# EAGLE board 612_jetracer_esp32s3_030005 (EAGLE 9.6.2)
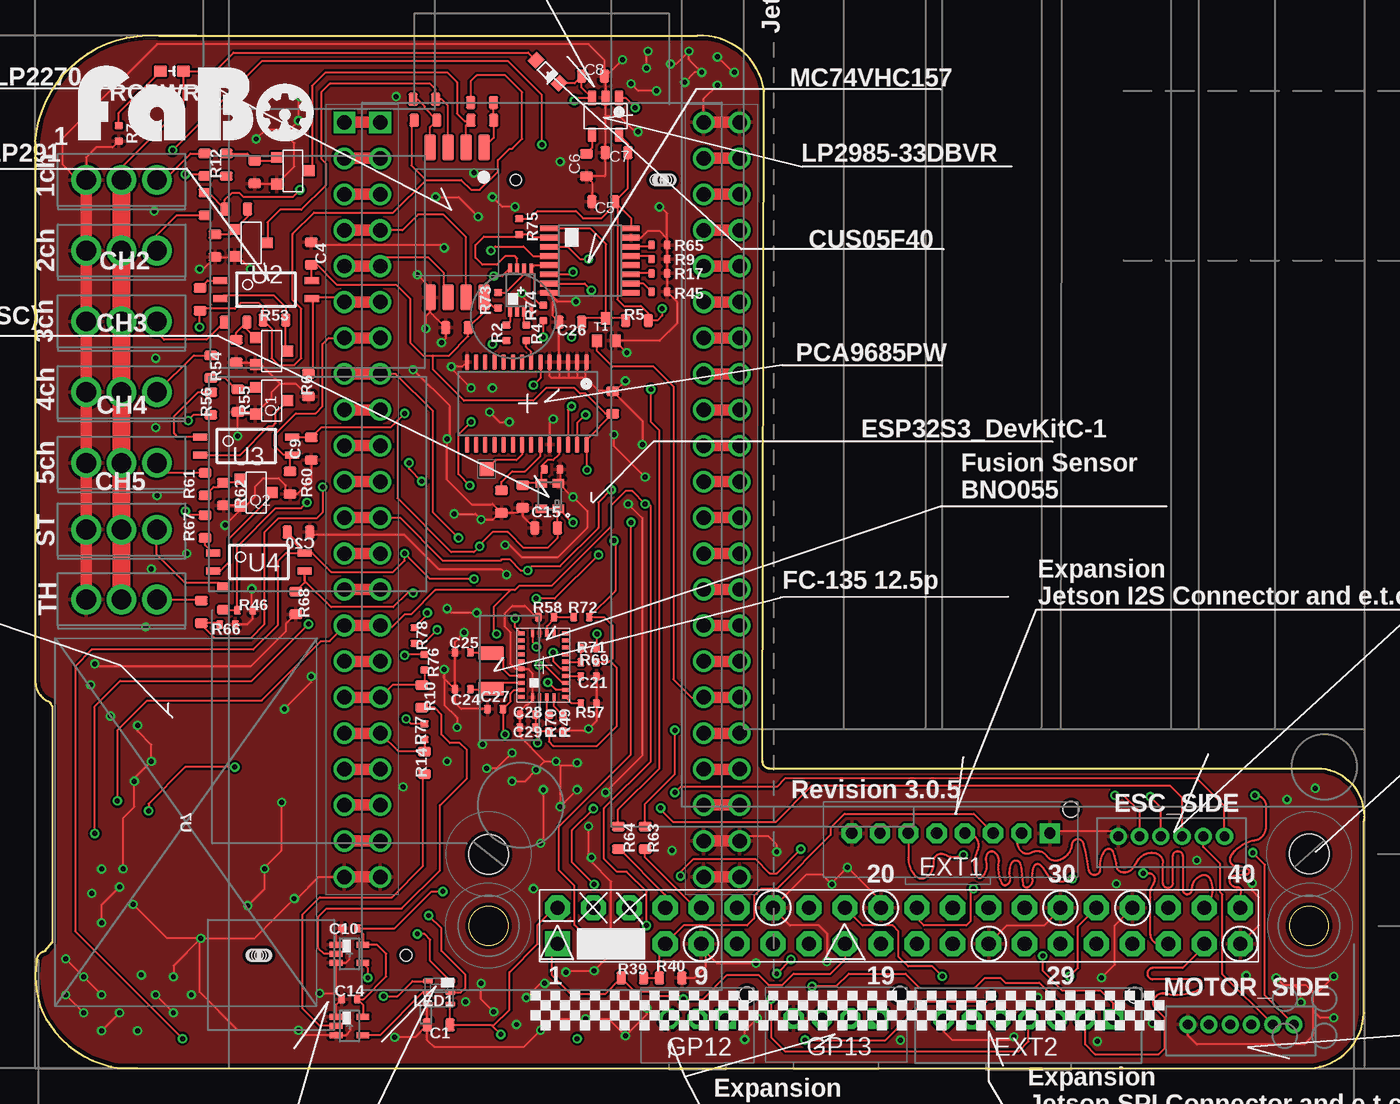
[diagram p5: board, top side]
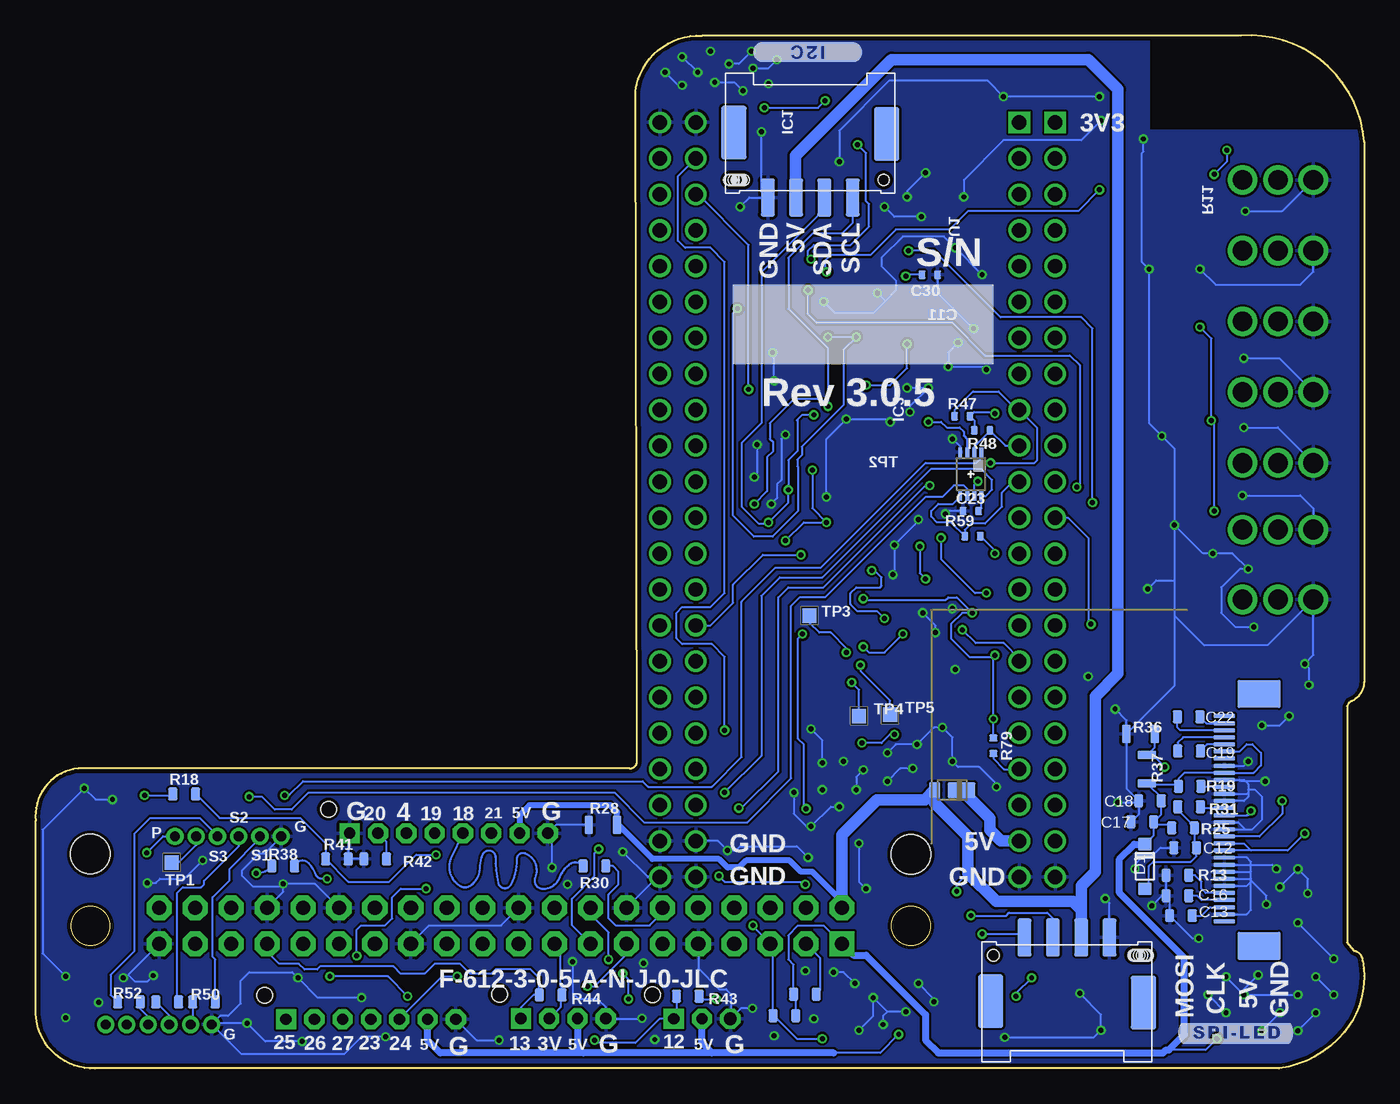
[diagram p6: board, bottom side, seen from below]

Size 93.92 x 73.02 mm. Coordinates in mm from the lower left corner, seen from the top.
Outline: 51.4,21.7 51.5,69.1 arc84 46.8,73 8.7,73 arc90 0,65.5 0,27.3 arc67 1,25.9 1.1,25.8 1.2,25.6 1.2,8.9 0.7,8.3 arc80 0.1,7.6 arc39 0.8,3.4 1,3.1 arc48 6,0 89.7,0 arc90 93.9,3.9 93.9,17.5 arc90 90.9,21.2 51.9,21.2 arc-96 51.4,21.7
Copper layers (1*16): Top 0.035mm / dielectric 1.6mm / Bottom 0.035mm
Design rules "PCBway": minimum track width 6mil, minimum drill 12mil, track to track 6mil, track to pad 6mil, pad to pad 6mil, via to via 6mil, smd to smd 6mil, copper to edge 10mil, drill to drill 10mil, minimum pad ring 10mil, minimum via ring 6mil, stop-mask expansion 2mil, vias tented up to drill 100mil, thermal gap 8mil
Holes 2.8 mm at 90.03,15.15 32.03,15.14
tKeepout: area 1.1,4.3 to 20,30.2
bKeepout: area 10.6,26.2 to 16.4,109
tRestrict: area 35.5,40 to 37.1,40.9
bRestrict: area 0.4,66.4 to 15.1,88.8; 9 lines

## Footprints (pad centres in the part's own frame; a part is rotated, then mirrored left to right if it is on the bottom)
3P-SCN = drill 1.4: 1 2.5,0; 2 0,0; 3 -2.5,0
0603 = smd 0.65 x 0.9: 1 -0.8,0; 2 0.8,0
0402 = smd 0.5 x 0.6: 1 -0.55,0; 2 0.55,0
1N4148W = smd 0.9 x 0.95: ANODE 0,0; CATHODE 3.15,0
CUS05F40 = smd 0.8 x 0.9: A -1.15,0; C 1.15,0
US2H = smd 0.8 x 1.1: A 1.25,0 | smd 2 x 1.1: K -0.65,0
B6B-ZR = drill 0.7 pad 1.016: 1 -3.75,0; 2 -2.25,0; 3 -0.75,0; 4 0.75,0; 5 2.25,0; 6 3.75,0
I2S-B08B-PASK-1 = drill 0.8 pad 1.422 octagon: 1:GND -7,0.02; 2:5V -5,0.02; 3:DOUT -3,0.02; 4:BCLK -1,0.02; 5:LRCLK 1,0.02; 6:MCK 3,0.02; 7:DIN 5,0.02 | drill 0.8 pad 1.422 square: 8:GND 7,0.02 | hole 1.1: 8.5,1.72
SPI-B07B-PASK-1 = drill 0.8 pad 1.422 octagon: 1 -6,1.27; 2 -4,1.27; 3 -2,1.27; 4 0,1.27; 5 2,1.27; 6 4,1.27 | drill 0.8 pad 1.422 square: 7 6,1.27 | hole 1.1: 7.5,2.97
FABO_BRICK_3PIN_B03B-PASK-1 = drill 0.9 pad 1.422 octagon: GND -2,0 | drill 0.8 pad 1.422 square: I/O 2,0 | drill 0.8 pad 1.422 octagon: VCC 0,0 | hole 1.1: 3.5,1.7
GPIO-B04B-PASK-1 = drill 0.8 pad 1.422 octagon: 3V3 1,0.02; 5V -1,0.02; GND -3,0.02 | drill 0.8 pad 1.422 square: IO 3,0.02 | hole 1.1: 4.5,1.72
JETSON_NANO_DEMENTION = drill 1 pad 1.778 square: 1 0,0 | drill 1 pad 1.778 octagon: 2 0,2.54; 3 2.54,0; 4 2.54,2.54; 5 5.08,0; 6 5.08,2.54; 7 7.62,0; 8 7.62,2.54; 9 10.16,0; 10 10.16,2.54; 11 12.7,0; 12 12.7,2.54; 13 15.24,0; 14 15.24,2.54; 15 17.78,0; 16 17.78,2.54; 17 20.32,0; 18 20.32,2.54; 19 22.86,0; 20 22.86,2.54; 21 25.4,0; 22 25.4,2.54; 23 27.94,0; 24 27.94,2.54; 25 30.48,0; 26 30.48,2.54; 27 33.02,0; 28 33.02,2.54; 29 35.56,0; 30 35.56,2.54; 31 38.1,0; 32 38.1,2.54; 33 40.64,0; 34 40.64,2.54; 35 43.18,0; 36 43.18,2.54; 37 45.72,0; 38 45.72,2.54; 39 48.26,0; 40 48.26,2.54
I2C-SM04B-PASS-1-FL = smd 1 x 2.7: 5V -1,0; GND -3,0; SCL 3,0; SDA 1,0 | smd 1.8 x 3.8: P$5 -5.4,4.6; P$6 5.4,4.5 | hole 0.8: 5.2,1.25; -4.7,1.25; -5.7,1.25; -5.6,1.25; -5.4,1.25; -5.2,1.25; -5.1,1.25; -5,1.25; -4.9,1.25
SOT-23-5 = smd 0.6 x 1.05: 1 -0.95,-1.3; 2 0,-1.3; 3 0.95,-1.3; 4 0.95,1.3; 5 -0.95,1.3
PCA9685 = smd 0.3 x 1.1: 1 -4.15,-2.93; 2 -3.5,-2.93; 3 -2.85,-2.93; 4 -2.2,-2.93; 5 -1.55,-2.93; 6 -0.9,-2.93; 7 -0.25,-2.93; 8 0.4,-2.93; 9 1.05,-2.93; 10 1.7,-2.93; 11 2.35,-2.93; 12 3,-2.93; 13 3.65,-2.93; 14 4.3,-2.93; 15 4.3,2.92; 16 3.65,2.92; 17 3,2.92; 18 2.35,2.92; 19 1.7,2.92; 20 1.05,2.92; 21 0.4,2.92; 22 -0.25,2.92; 23 -0.9,2.92; 24 -1.55,2.92; 25 -2.2,2.92; 26 -2.85,2.92; 27 -3.5,2.92; 28 -4.15,2.92
APA102_2020 = smd 0.7 x 0.35: CKI 0.8,0; CKO -0.8,0; GND 0.8,0.8; SDI 0.8,-0.8; SDO -0.8,-0.8; VCC -0.8,0.8
SUPERSOT-3 = smd 0.76 x 0.76: D 0,1.15; G -0.95,-1.15; S 0.95,-1.15
0805 = smd 0.6 x 1.3: 1 -1,0; 2 1,0
0603' = smd 0.9 x 0.8: ANODE -0.8,0; CATHODE 0.8,0
SPI-SM04B-PASS-1-FL = smd 1 x 2.7: 5V -1,-0.1; CI 1,-0.1; DI 3,-0.1; GND -3,-0.1 | smd 1.8 x 3.8: P$5 -5.4,4.5; P$6 5.4,4.4 | hole 0.8: 5.2,1.15; -4.7,1.15; -5.7,1.15; -4.8,1.15; -4.9,1.15; -5.1,1.15; -5.3,1.15; -5.5,1.15; -5.6,1.15
SOT-323FL/SC-85(UMT3F) = smd 0.8 x 0.9: 1 0.65,-0.8; 2 -0.65,-0.8; 3 0,0.8
TESTPOINT_SMD-10SN = smd 1 x 1: TP 0,0
TLP2270 = smd 0.8 x 1.8: 1 -1.905,-5.3; 2 -0.635,-5.3; 3 0.635,-5.3; 4 1.905,-5.3; 5 1.905,5.3; 6 0.635,5.3; 7 -0.635,5.3; 8 -1.905,5.3
11-3C1 = smd 1 x 0.5: 1 -3.24,0.635; 2 -3.24,-0.635; 3 3.24,-0.635; 4 3.24,0.635
ER-CON30HT-1 = smd 0.3 x 1.5 bottom: 1 7,-0.23; 2 6.5,-0.23; 3 6,-0.23; 4 5.5,-0.23; 5 5,-0.23; 6 4.5,-0.23; 7 4,-0.23; 8 3.5,-0.23; 9 3,-0.23; 10 2.5,-0.23; 11 2,-0.23; 12 1.5,-0.23; 13 1,-0.23; 14 0.5,-0.23; 15 0,-0.23; 16 -0.5,-0.23; 17 -1,-0.23; 18 -1.5,-0.23; 19 -2,-0.23; 20 -2.5,-0.23; 21 -3,-0.23; 22 -3.5,-0.23; 23 -4,-0.23; 24 -4.5,-0.23; 25 -5,-0.23; 26 -5.5,-0.23; 27 -6,-0.23; 28 -6.5,-0.23; 29 -7,-0.23; 30 -7.5,-0.23 | smd 2 x 3 bottom: 31 -9.07,-2.67; 32 8.74,-2.67
MC74VHC157_TSSOP-16 = smd 1.26 x 0.36: 1 -2.9,2.275; 2 -2.9,1.625; 3 -2.9,0.975; 4 -2.9,0.325; 5 -2.9,-0.325; 6 -2.9,-0.975; 7 -2.9,-1.625; 8 -2.9,-2.275; 9 2.9,-2.275; 10 2.9,-1.625; 11 2.9,-0.975; 12 2.9,-0.325; 13 2.9,0.325; 14 2.9,0.975; 15 2.9,1.625; 16 2.9,2.275
SOT-765 = smd 0.3 x 0.6: 1 -0.75,-1.55; 2 -0.25,-1.55; 3 0.25,-1.55; 4 0.75,-1.55; 5 0.75,1.55; 6 0.25,1.55; 7 -0.25,1.55; 8 -0.75,1.55
SOT-1DOT1 = smd 0.4 x 0.95: 1 -0.65,-0.95; 2 0,-0.95; 3 0.65,-0.95; 4 0.65,0.95; 5 -0.65,0.95
KC2016Z = smd 0.6 x 0.8: #1 -0.9,-0.6; #2 0.9,-0.6; #3 0.9,0.6; #4 -0.9,0.6
LGA = smd 0.25 x 0.475: 1 -2.25,1.562; 6 -2.25,-1.562; 7 -1.75,-1.562; 8 -1.25,-1.562; 9 -0.75,-1.562; 10 -0.25,-1.562; 11 0.25,-1.562; 12 0.75,-1.562; 13 1.25,-1.562; 14 1.75,-1.562; 15 2.25,-1.562; 20 2.25,1.562; 21 1.75,1.562; 22 1.25,1.562; 23 0.75,1.562; 24 0.25,1.562; 25 -0.25,1.562; 26 -0.75,1.562; 27 -1.25,1.562; 28 -1.75,1.562 | smd 0.475 x 0.25: 2 -2.263,0.75; 3 -2.263,0.25; 4 -2.263,-0.25; 5 -2.263,-0.75; 16 2.263,-0.75; 17 2.263,-0.25; 18 2.263,0.25; 19 2.263,0.75
ESP32S3DEVKITC-1-DUAL = drill 1.02 square: 1:3V3 -11.43,26.67; 1:3V3_L -13.97,26.67 | drill 1.02: 1:GND_J3 11.43,26.67; 1:GND_J3R 13.97,26.67; 2:3V3 -11.43,24.13; 2:3V3_L -13.97,24.13; 2:GPIO43 11.43,24.13; 2:GPIO43_R 13.97,24.13; 3:GPIO44 11.43,21.59; 3:GPIO44_R 13.97,21.59; 3:RST -11.43,21.59; 3:RST_L -13.97,21.59; 4:GPIO1 11.43,19.05; 4:GPIO1_R 13.97,19.05; 4:GPIO4 -11.43,19.05; 4:GPIO4_L -13.97,19.05; 5:GPIO2 11.43,16.51; 5:GPIO2_R 13.97,16.51; 5:GPIO5 -11.43,16.51; 5:GPIO5_L -13.97,16.51; 6:GPIO6 -11.43,13.97; 6:GPIO6_L -13.97,13.97; 6:GPIO42 11.43,13.97; 6:GPIO42_R 13.97,13.97; 7:GPIO7 -11.43,11.43; 7:GPIO7_L -13.97,11.43; 7:GPIO41 11.43,11.43; 7:GPIO41_R 13.97,11.43; 8:GPIO15 -11.43,8.89; 8:GPIO15_L -13.97,8.89; 8:GPIO40 11.43,8.89; 8:GPIO40_R 13.97,8.89; 9:GPIO16 -11.43,6.35; 9:GPIO16_L -13.97,6.35; 9:GPIO39 11.43,6.35; 9:GPIO39_R 13.97,6.35; 10:GPIO17 -11.43,3.81; 10:GPIO17_L -13.97,3.81; 10:GPIO38 11.43,3.81; 10:GPIO38_R 13.97,3.81; 11:GPIO18 -11.43,1.27; 11:GPIO18_L -13.97,1.27; 11:GPIO37 11.43,1.27; 11:GPIO37_R 13.97,1.27; 12:GPIO8 -11.43,-1.27; 12:GPIO8_L -13.97,-1.27; 12:GPIO36 11.43,-1.27; 12:GPIO36_R 13.97,-1.27; 13:GPIO3 -11.43,-3.81; 13:GPIO3_L -13.97,-3.81; 13:GPIO35 11.43,-3.81; 13:GPIO35_R 13.97,-3.81; 14:GPIO0 11.43,-6.35; 14:GPIO0_R 13.97,-6.35; 14:GPIO46 -11.43,-6.35; 14:GPIO46_L -13.97,-6.35; 15:GPIO9 -11.43,-8.89; 15:GPIO9_L -13.97,-8.89; 15:GPIO45 11.43,-8.89; 15:GPIO45_R 13.97,-8.89; 16:GPIO10 -11.43,-11.43; 16:GPIO10_L -13.97,-11.43; 16:GPIO48 11.43,-11.43; 16:GPIO48_R 13.97,-11.43; 17:GPIO11 -11.43,-13.97; 17:GPIO11_L -13.97,-13.97; 17:GPIO47 11.43,-13.97; 17:GPIO47_R 13.97,-13.97; 18:GPIO12 -11.43,-16.51; 18:GPIO12_L -13.97,-16.51; 18:GPIO21 11.43,-16.51; 18:GPIO21_R 13.97,-16.51; 19:GPIO13 -11.43,-19.05; 19:GPIO13_L -13.97,-19.05; 19:GPIO20 11.43,-19.05; 19:GPIO20_R 13.97,-19.05; 20:GPIO14 -11.43,-21.59; 20:GPIO14_L -13.97,-21.59; 20:GPIO19 11.43,-21.59; 20:GPIO19_R 13.97,-21.59; 21:5V0 -11.43,-24.13; 21:5V0_L -13.97,-24.13; 21:GND_J3 11.43,-24.13; 21:GND_J3_R 13.97,-24.13; 22:GND_J1 -11.43,-26.67; 22:GND_J1L -13.97,-26.67; 22:GND_J3 11.43,-26.67; 22:GND_J3_R 13.97,-26.67
FC-135 = smd 1 x 1.8: 1 -1.25,0; 2 1.25,0

## Placement (x,y rotation side)
1  3P-SCN  [3P-SCN]  6.09,62.8 0 top
C1  10uF  [0603]  28.5,3.07 0 top
C2  0.1uF  [0603]  40.8,47.07 270 top
C3  20pF  [0402]  36.53,42.34 180 top
C4  0.1uF  [0603]  19.5,57.6 270 top
C5  0.1uF  [0603]  40.14,61.27 0 top
C6  0.01uF  [0603]  38.94,63.86 90 top
C7  2.2uF  [0603]  41.08,64.73 0 top
C8  1uF  [0603]  39.42,70.14 180 top
C9  0.1uF  [0603]  19.5,43.8 90 top
C10  0.1uF  [0402]  22.2,9.9 0 top
C11  0.1uF  [0603]  29.8,52.35 0 top
C12  10uF  [0603]  12.65,15.6 0 bottom
C13  10uF  [0603]  12.95,10.8 0 bottom
C14  0.1uF  [0402]  22.2,4.9 0 top
C15  10uF  [0603]  36.1,38.2 0 top
C16  10uF  [0603]  13.2,12.2 0 bottom
C17  1uF  [0603]  15.68,17.43 0 bottom
C18  1uF  [0603]  15.14,18.92 0 bottom
C19  1uF  [0603]  12.38,22.43 180 bottom
C20  0.1uF  [0603]  18.6,37.9 180 top
C21  0.1uF  [0402]  39.1,27.7 180 top
C22  1uF  [0603]  12.4,24.85 0 bottom
C23  0.1uF  [0402]  27.8,39.4 0 bottom
C24  22pF  [0402]  30.2,26.8 180 top
C25  22pF  [0402]  30.2,29.4 180 top
C26  0.1uF  [0603]  37.81,52.75 0 top
C27  0.1uF  [0402]  32.5,25.4 0 top
C28  0.1uF  [0402]  34.8,25 0 top
C29  0.1uF  [0402]  34.8,24.1 0 top
C30  0.1uF  [0402]  30.7,56.1 180 bottom
CH2  3P-SCN  [3P-SCN]  6.09,57.8 0 top
CH3  3P-SCN  [3P-SCN]  6.09,52.8 0 top
CH4  3P-SCN  [3P-SCN]  6.09,47.8 0 top
CH5  3P-SCN  [3P-SCN]  6.09,42.8 0 top
D1  1N4148  [1N4148W]  15.5,12.7 90 bottom
D2  CUS05F40  [CUS05F40]  36.19,70.45 315 top
D3  CUHS20S30  [US2H]  29.11,19.67 180 bottom
ESC_CON  BRUSHLESSMOTOR_CON  [B6B-ZR]  80.3,16.4 0 top
EXT1  FABO-I2S-2  [I2S-B08B-PASK-1]  64.7,16.6 0 top
EXT2  FABO-SPI-7PIN  [SPI-B07B-PASK-1]  70.2,2.2 0 top
GP12  [FABO_BRICK_3PIN_B03B-PASK-1]  46.8,3.5 0 top
GP13  FABO-GPIO-2G  [GPIO-B04B-PASK-1]  56.6,3.5 0 top
GPIO40  JETSON_NANOJETSON_NANO_OVERALL  [JETSON_NANO_DEMENTION]  36.9,8.8 0 top
I2C  FABO-I2C  [I2C-SM04B-PASS-1-FL]  39.15,61.55 0 bottom
IC1  [SOT-23-5]  40.3,67.3 180 top
IC2  [PCA9685]  34.8,47 180 top
LED1  [APA102_2020]  28.54,5.36 180 top
MOTOR  BRUSHLESSMOTOR_CON  [B6B-ZR]  85.2,3.1 0 top
Q1  MOSFET-N_FDN335N  [SUPERSOT-3]  16.7,47.2 270 top
Q2  MOSFET-N_FDN335N  [SUPERSOT-3]  15.6,40.7 270 top
Q3  MOSFET-N_FDN335N  [SUPERSOT-3]  16.7,50.7 270 top
Q4  MOSFET-N_FDN335N  [SUPERSOT-3]  15.25,58.35 270 top
Q5  MOSFET-N_FDN335N  [SUPERSOT-3]  18.2,63.45 270 top
R1  DNP  [0603]  34.44,40.43 90 top
R2  220  [0402]  33.3,52 270 top
R3  0  [0603]  32.95,40.06 90 top
R4  220  [0402]  34.7,52 270 top
R5  100K  [0603]  42.52,52.86 0 top
R6  4.7K  [0603]  19.3,48.3 270 top
R7  1K  [0402]  5.9,66.1 270 top
R8  470  [0603]  14.15,52.75 180 top
R9  10K  [0402]  44.1,57.2 180 top
R10  0  [0603]  27.3,26.3 270 top
R11  22  [0603]  12,61.1 90 top
R12  22  [0603]  11.98,63.87 270 top
R13  390K  [0603]  13.2,13.65 180 bottom
R14  0  [0603]  27.5,21.6 270 top
R15  680  [0603]  27.57,67.02 180 top
R16  680  [0603]  31.57,68.27 180 top
R17  10K  [0402]  44.1,56.2 180 top
R18  51  [0603]  83.4,19.4 0 bottom
R19  10K  [0603]  12.33,19.93 0 bottom
R20  51  [0603]  13.28,33.22 90 top
R21  51  [0603]  11.72,32.27 90 top
R22  DNF  [0603]  40.98,3.72 0 bottom
R23  DNF  [0603]  39.53,5.25 180 bottom
R24  100K  [0603]  14.2,50.7 270 top
R25  10K  [0603]  12.8,17 0 bottom
R26  180  [0603]  11.64,54.36 270 top
R27  DNP  [0603]  27.5,68.5 180 top
R28  510  [0805]  53.8,17.2 0 bottom
R29  DNP  [0603]  31.59,67.01 180 top
R30  51  [0603]  54.4,14.3 180 bottom
R31  100  [0603]  12.38,18.48 0 bottom
R32  100K  [0603]  15.5,63.35 270 top
R33  100K  [0603]  12.7,58.15 270 top
R34  470  [0603]  13.49,63.87 90 top
R35  470  [0603]  14.2,60.75 0 top
R36  0/0805  [0805]  15.8,23.65 0 bottom
R37  DNP  [0805]  15.35,21.15 270 bottom
R38  51  [0603]  76.4,14.3 0 bottom
R39  DNF  [0603]  42.2,6.4 0 top
R40  DNF  [0603]  44.9,6.4 0 top
R41  100K  [0603]  72.6,14.8 0 bottom
R42  100K  [0603]  69.9,14.8 180 bottom
R43  DNF  [0603]  47.8,5.1 180 bottom
R44  DNF  [0603]  57.5,5.2 180 bottom
R45  10K  [0402]  44.1,54.9 180 top
R46  1K  [0402]  14.82,32.38 0 top
R47  10K  [0402]  28.4,46.1 0 bottom
R48  10K  [0402]  27,45.1 180 bottom
R49  10K  [0402]  37.3,24.4 90 top
R50  22  [0603]  82,4.7 0 bottom
R51  22  [0603]  84.6,4.7 0 bottom
R52  22  [0603]  87.3,4.7 180 bottom
R53  DNP  [0603]  16.9,52.9 0 top
R54  470  [0603]  12.4,49.6 90 top
R55  100K  [0603]  14.3,47.2 270 top
R56  180  [0603]  12.4,47 270 top
R57  10K  [0402]  39.1,25.8 180 top
R58  10K  [0402]  36.1,31.9 0 top
R59  10K  [0402]  27.68,37.62 0 bottom
R60  4.7K  [0603]  18,41.4 270 top
R61  470  [0603]  12,41.3 90 top
R62  100K  [0603]  13.3,40.6 270 top
R63  DNP  [0603]  43.1,16.3 270 top
R64  DNP  [0603]  41.2,16.3 270 top
R65  10K  [0402]  44.1,58.2 180 top
R66  1K  [0402]  13.58,31.37 0 top
R67  180  [0603]  12,38.3 90 top
R68  4.7K  [0603]  18.4,32.9 270 top
R69  10K  [0402]  39.1,28.7 0 top
R70  10K  [0402]  36.3,24.4 270 top
R71  10K  [0402]  39.1,29.7 180 top
R72  DNP  [0402]  38.6,31.9 0 top
R73  10K  [0402]  32.7,54.3 90 top
R74  10K  [0402]  35.9,53.4 90 top
R75  10K  [0402]  34.2,59.5 270 top
R76  10K  [0402]  27.5,28.7 270 top
R77  10K  [0402]  27.5,23.8 270 top
R78  10K  [0402]  26.8,30.6 270 top
R79  10K  [0402]  26.2,22.8 270 bottom
RCPWR  ORANGE  [0603']  9.65,70.5 180 top
SPI-LED  [SPI-SM04B-PASS-1-FL]  21,9.15 180 bottom
ST  3P-SCN  [3P-SCN]  6.09,38.08 0 top
T1  DTC114EU3  [SOT-323FL/SC-85(UMT3F)]  40.34,52.23 0 top
TH  3P-SCN  [3P-SCN]  6.09,33.15 0 top
TP1  TESTPOINT_TPS-SMD-10SN  [TESTPOINT_SMD-10SN]  84.29,14.55 0 bottom
TP2  TESTPOINT_TPS-SMD-10SN  [TESTPOINT_SMD-10SN]  31.9,42.36 0 top
TP3  TESTPOINT_TPS-SMD-10SN  [TESTPOINT_SMD-10SN]  39.2,32 0 bottom
TP4  TESTPOINT_TPS-SMD-10SN  [TESTPOINT_SMD-10SN]  35.7,24.9 0 bottom
TP5  TESTPOINT_TPS-SMD-10SN  [TESTPOINT_SMD-10SN]  33.5,25 0 bottom
U1  [TLP2270]  29.8,59.8 180 top
U2  TLP291A  [11-3C1]  16.3,55.05 0 top
U3  TLP291A  [11-3C1]  14.9,44 0 top
U4  TLP291A  [11-3C1]  15.8,35.8 0 top
U7  [ER-CON30HT-1]  10.1,17.4 270 top
U$1  MC74VHC157  [MC74VHC157_TSSOP-16]  39.2,57.1 0 top
U$2  [LOGO_FABO_L]  10.65,65.54 0 top
U$3  TC7WZ07FK  [SOT-765]  27.8,42 180 bottom
U$5  TC7WZ07FK  [SOT-765]  34.3,55 0 top
U$9  SN74AHCT1G125  [SOT-1DOT1]  22.2,8.1 270 top
U$10  SN74AHCT1G125  [SOT-1DOT1]  22.2,3 270 top
U$11  KC2016Z  [KC2016Z]  36.37,40.46 90 top
U$13  BNO055  [LGA]  35.9,28.5 90 top
U$14  ESP32S3DEVKITC-1-DUAL  [ESP32S3DEVKITC-1-DUAL]  35.8,40.2 0 top
X1  FC-135  [FC-135]  32.2,28.1 90 top

## Tracks (layer width: path | path; a pad name or v marks a point on that pad's centre or on a via)
3V3_JETSON  (via drill 0.35)
  Top 0.152: GPIO40.17 57.22,7.72 56.2,6.7 53.6,6.7 52.8,5.9 51.8,5.9 51.1,6.6 48.9,6.6 47.2,4.9 v45.8,4.9 45.6,5.1 43.7,5.1 43.4,5.4 42.4,5.4 R39.1 40.25,5.25 37.85,5.25 36.5,6.6 36.5,8.4 GPIO40.1 | U$11.#4 U$11.#1 | U$11.#1 37.01,39.52 | 28.1,50.4 29.25,50.4 30.6,51.75 C11.2 31.7,53.45 U1.8 | U$11.#1 37.93,38.6 v38,38.6 | v39,42.3 39,44.03 IC2.28 38.95,44.43 C2.2 40.3,46.27 38.88,47.69 38.52,47.69 38.1,48.1 36.1,48.1 35.2,47.2 30.3,47.2 28.1,49.4 28.1,50.4 | v10.4,2.1 2.8,9.7 2.8,28.4 4,29.6 15.4,29.6 17.15,31.35 17.15,35.85 17.73,36.44 U4.4 | U$11.#1 36.9,39.49 C15.2 36.9,37.5 36.2,36.8 34.5,36.8 33.4,37.9 32.3,37.9 31.4,37 v31.4,36.9 31,36.5 29.4,36.5 25.6,40.3 25.6,45.8 v26.1,46.3 25.1,45.3 20.2,45.3 C9.2 19.46,44.63 U3.4 | U4.4 18.4,37.08 18.4,37.3 C20.2 | U4.4 19.57,36.44 20.9,35.1 25.3,35.1 26.1,35.9 v26.1,36.4 27.9,34.6 v31,34.6 | U2.4 19.54,56.76 C4.2 19.9,56.8 21.3,55.4 25.5,55.4 26.5,54.4 26.5,51.3 27.4,50.4 28.1,50.4 | U$13.28 33.85,26.75 33.6,26.5 33.6,25.95 C27.2 33.05,23.75 v33.2,23.6 | U$13.3 35.65,25.3 C28.2 35.35,24.2 | 35.35,24.2 C29.2 35.6,23.85 R70.2 36.3,23.1 36.6,22.8 39.7,22.8 41.1,24.2 41.1,28.3 40.6,28.8 | 40.6,28.8 40.8,29 40.8,31.3 40.2,31.9 R72.2 41,33.75 41,37.2 v40.9,37.3 | 40.6,28.8 40.5,28.7 R69.2 | v35.5,23 35.5,24.05 35.35,24.2 | R73.1 32.45,53.75 U1.8 | U1.8 31.7,55.1 | U1.8 31.7,55.3 v32.4,56 33,56 U$5.8
  Bottom 0.152: R22.2 40.17,5.1 R23.2 40.33,7.33 40.7,7.7 40.7,9.4 40,10.1 38.2,10.1 GPIO40.1 | R43.1 46.8,4.9 v45.8,4.9 | GPIO40.17 56.82,8.4 56.82,5.82 56.7,5.7 R44.1 56.8,5.1 56.8,4.32 GP13.3V3 | v39,42.3 39,39.6 v38,38.6 39.6,38.6 v40.9,37.3 | R37.2 15.25,20.05 | 15.25,20.05 14.34,19.14 C18.2 14.34,17.97 C17.2 14.88,17.2 | D1.CATHODE 14.88,16.47 14.88,17.2 | v10.4,2.1 11.2,1.3 14,1.3 | U7.25 8.8,22.4 8.3,22.9 7.9,22.9 7.3,22.3 7.3,21.4 7.8,20.9 U7.22 12.7,20.9 13.13,20.47 R19.1 13.25,20.05 15.25,20.05 | R25.1 13.8,17.2 14.88,17.2 | R48.2 27.55,45.8 R47.2 27.55,46.4 26.2,46.4 v26.1,46.3 | v26.1,36.4 26.1,36.59 R59.2 | v31.4,36.9 31.4,35 v31,34.6 | v33.2,23.6 33.5,23.6 34.1,23 v35.5,23 | C30.2 32.3,56.1 v32.4,56
  Bottom 0.508: GPIO40.1 36.1,8 35.2,8 31,3.8 31,2 30.1,1.1 14.2,1.1 14,1.3 13.8,1.3 12.7,2.4 12.7,7.8 17.3,12.4 17.3,14.8 16.25,15.85 D1.CATHODE
5V_JETSON  (via drill 0.35)
  Top 0.152: U$10.5 23.15,4.5 C14.2 23.2,4.9 24.8,6.5 24.8,8.1 24.15,8.75 U$9.5 23.15,9.5 C10.2 25.4,9.9 28,12.5 v28.8,12.5 | LED1.VCC 29.3,4.52 C1.2 32.23,3.07 32.33,2.97 | 32.33,2.97 v32.9,2.4 | 36.64,11.34 36.7,11.34 | 36.7,11.34 GPIO40.2 | 32.33,2.97 33.5,4.14 33.5,6.8 35.5,8.8 35.5,10.14 36.7,11.34
  Bottom 0.152: v32.9,2.4 34.2,1.1 37.5,1.1 | v28.8,12.5 28.8,13 28,13.8
  Bottom 0.406: GPIO40.2 36.9,11.8 39,13.9 39.8,13.9 40.6,14.7 43.69,14.7 44.19,14.2 45,14.2 45.6,14.8 50.3,14.8 52.7,17.2 R28.2 52.8,18.1 53.3,18.6 59,18.6 59.7,17.9 EXT1.2:5V
  Bottom 0.508: 37.5,1.1 46.1,1.1 | GP12.VCC 46.8,1.8 46.1,1.1 | 46.1,1.1 55.2,1.1 | 55.2,1.1 65.3,1.1 66.2,2 EXT2.2 | GP13.5V 55.6,1.5 55.2,1.1
  Bottom 0.813: GPIO40.2 36.9,16.5 34.43,18.97 31.06,18.97 D3.A 30.36,18.76 28,16.4 28,13.8 26,11.8 20.6,11.8 20,11.2 | SPI-LED.5V 20,11.2 | 20,11.2 20,12.9 19,13.9 19,26.3 17.4,27.9 17.4,69.2 19.5,71.3 33.4,71.3 40.2,64.5 40.2,61.6 I2C.5V
5VL_JETSON
  Top 0.813: U$14.21:5V0_L U$14.21:5V0
  Bottom 0.813: D3.K 26.46,17.67 26.46,16.87 25.66,16.07 U$14.21:5V0
AI_CH1_ST
  Top 0.152: U$5.1 33.55,52.8 R2.1
AI_CH2_TH
  Top 0.152: R4.1 34.55,52.7 U$5.3
BEC\MAX3A
  Top 0.152: D2.A 34.83,71.8 14,71.8 12.7,70.5 RCPWR.ANODE 10.45,68.05 6.09,63.69 1.2 6.09,63.09
  Top 1.27: TH.2 ST.2 CH5.2 CH4.2 CH3.2 CH2.2 1.2
BEC_3V3  (via drill 0.35)
  Top 0.152: IC1.5 41.88,65.37 C7.2 41.88,62.2 C5.2 | C5.2 42.1,60.11 U$1.16 | C5.2 41.14,61.07 41.14,54.36 41.6,53.9 42.8,53.9 43.32,53.38 R5.2 43.96,52.86 44.3,53.2 v44.3,53.7 | R74.1 v35.9,51.7 | R75.1 34.95,60.05 35.5,60.6 38.2,60.6 38.7,60.1 40,60.1 40.94,61.04 C5.2
  Bottom 0.152: v37.9,51.7 v35.9,51.7 36.8,50.8 36.8,46.9 39.74,43.95 39.74,43.34 40.06,43.03 40.06,42.57 40,42.51 40,39.41 41.82,37.59 43.13,37.59 44.6,39.07 44.6,53.4 v44.3,53.7
BEC_60  (via drill 0.35)
  Top 0.152: D2.C 38.11,69.63 C8.2 38.62,69.33 IC1.3 38.3,68.6 v38.1,68.4 | IC1.1 41.7,68.6 v42.4,67.9
  Bottom 0.152: v42.4,67.9 38.6,67.9 v38.1,68.4
BEC_62  (via drill 0.35)
  Top 0.152: R15.2 26.77,66.8 26.57,66.8 | 26.57,66.8 26.57,63.83 27.6,62.8 | R16.2 30.77,69.78 31.2,70.2 33.2,70.2 34.4,69 34.4,65.7 33.7,65 33.5,65 32.7,64.2 32.7,63.4 31.4,62.1 30.8,62.1 30.1,62.8 27.6,62.8 | 26.5,66.8 26.57,66.8 | R67.2 10.9,39.1 v10.6,39.4 | v10.8,45.8 11.2,46.2 R56.2 | v11.6,52.4 11.6,53.4 | 11.6,53.4 11.6,53.52 R26.2 | 11.6,53.4 11.9,53.7 14.1,53.7 14.5,54.1 15.8,54.1 16.1,53.8 R53.1 16.7,52.3 16.7,50.2 17.2,49.7 18.3,49.7 18.8,50.2 18.8,53.7 18.2,54.3 18.2,59 19.7,60.5 25.3,60.5 27.6,62.8
  Bottom 0.152: v10.6,39.4 10.6,45.6 v10.8,45.8 10.8,51.6 v11.6,52.4
BNO_RESET
  Top 0.152: U$13.11 37.51,28.7 R69.1 R71.2
CH1(ST)
  Top 0.152: U1.7 30.43,58.77 28.85,60.35 27.05,60.35 25.95,59.25 U$14.4:GPIO4
  Top 0.813: U$14.4:GPIO4_L U$14.4:GPIO4
CH2(TH)
  Top 0.152: U1.6 28.86,54.8 28.86,56.23 27.79,57.31 24.7,57.31 24.1,56.71
  Top 0.813: U$14.5:GPIO5 24.1,56.71 U$14.5:GPIO5_L
CH3(SEL)
  Top 0.152: U$14.6:GPIO6_L 21.78,54.17 21.43,54.52 19.9,54.52 19.8,54.41 | 19.8,54.41 U2.3 | R6.1 19.6,49.4 19.6,54.22 19.8,54.41
  Top 0.813: U$14.6:GPIO6_L U$14.6:GPIO6
CH4(OPTION1)
  Top 0.152: R60.1 18,43.23 U3.3 17.54,43.37 16.9,44 16.9,44.8 18.4,46.3 19.8,46.3 20.3,46.8 20.3,51.2 20.73,51.63 U$14.7:GPIO7_L
  Top 0.813: U$14.7:GPIO7_L U$14.7:GPIO7
CH5(OPTION5)  (via drill 0.35)
  Top 0.152: R68.1 19.04,34.34 U4.3 19.04,34.47 20.91,32.6 25.3,32.6 26.3,33.6 v26.7,33.6 | v29.9,37.5 28.1,39.3 28.1,46.46 25.47,49.09 U$14.8:GPIO15
  Top 0.813: U$14.8:GPIO15_L U$14.8:GPIO15
  Bottom 0.152: v29.9,37.5 29.9,36 27.5,33.6 v26.7,33.6
CLK2  (via drill 0.35)
  Top 0.152: LED1.CKO 30.06,5.36 30.4,5.7 30.4,6.6 28.7,8.3 28.7,9.9 v27.8,10.8
  Bottom 0.152: v27.8,10.8 25.3,10.8 25.1,11 22.4,11 22,10.6 SPI-LED.CI
CLK_HV
  Top 0.152: LED1.CKI 27.36,5.36 24.35,2.35 U$10.4
CLK_LV
  Top 0.152: U$10.2 20.1,3 18.9,4.2 18.9,10.9 20.1,12.1 25.2,12.1 27.4,14.3 27.4,20.7 R14.2
ESP32_MOSI1
  Top 0.152: 27.07,27.33 R10.1 | R10.1 25.24,27.1 U$14.17:GPIO11 | R10.1 27.5,27.3 R76.2
  Top 0.813: U$14.17:GPIO11_L U$14.17:GPIO11
ESP32_SCK1
  Top 0.152: U$14.18:GPIO12 25.66,22.4 R14.1 R77.2
  Top 0.813: U$14.18:GPIO12_L U$14.18:GPIO12
G18
  Bottom 0.152: R30.2 arc-93 56.2,14.4 arc-27 56.86,13.47 arc72 58.1,12.7 arc108 58.59,13.48 arc-54 58.69,14.69 arc-37 59.3,15.2 arc-113 59.88,14.79 arc31 60.3,12.99 arc137 61.2,13.1 arc17 61.4,14.92 arc-162 62.3,15.1 arc-18 62.5,14.1 arc56 63.2,12.9 arc63 63.9,12.9 arc83 64.5,14.9 EXT1.4:BCLK
G19  (via drill 0.35)
  Top 0.152: v73.3,13.4 73.15,13.4 arc-95 71.4,13.9 arc24 71,14.4 arc106 70.6,14.3 arc31 70.48,13.38 arc-84 70.1,12.8 arc-96 69.8,13 arc-6 69.7,14 arc17 69.6,14.5 arc73 69.3,14.7 arc62 69,14.5 arc40 68.9,13.5 arc-82 68.62,12.96 arc-90 68.3,13.1 arc-29 68.1,14.6 arc67 67.75,15.29 arc83 67.32,15.2 arc52 67.2,14.6 arc-61 66.89,13.5 arc-110 66.56,13.57 arc-31 66.4,14.7 arc-17 66.6,15.4 arc121 EXT1.5:LRCLK
  Bottom 0.152: v73.3,13.4 73.65,13.4 arc67 74.1,13.7 arc-8 74.3,14.1 arc-13 74.6,14.5 arc-116 R38.2
G21  (via drill 0.35)
  Top 0.152: EXT1.3:DOUT 61.7,14.9 arc37 62.1,13.7 arc95 63.1,13.6 arc53 63.5,14.6 arc-125 64.3,15.1 arc61 v65.6,15.1
  Bottom 0.152: R18.2 80.9,17.7 75.2,17.7 73.4,15.9 R41.1 71.8,13.2 68.9,13.2 67,15.1 v65.6,15.1
GND  (via drill 0.35)
  Top 0.152: GPIO40.9 47.52,8.8 | 52.14,11.24 52.14,11.3 | 52.14,11.3 GPIO40.14 54.5,13.7 55.6,13.7 v56.3,13 56.3,13.1 v57.4,14.2 59.76,11.84 GPIO40.20 | GPIO40.25 68.68,10.1 71.3,10.1 72.46,11.26 GPIO40.30 | 77.54,10.74 GPIO40.34 76.3,10.1 76.3,7.34 v75.36,6.4 | v34.7,5 35.7,6 v36,6 | R40.2 46.6,6.4 47.4,7.2 47.4,8.46 GPIO40.9 | v69.16,2.24 68.92,2 64.8,2 64.2,2.6 EXT2.1 | v50.94,7.44 50.9,7.4 48.2,7.4 47.06,8.54 GPIO40.9 | v55.96,7.54 55.96,9.54 55.4,10.1 53.34,10.1 52.14,11.3 | v37.5,6.8 37.6,6.9 v39.5,6.9 40.7,8.1 40.7,13.2 39.3,14.6 v39.3,14.9 39.1,15.1 v39.1,17.1 | v43.24,4.24 43.24,3.84 v41.7,2.3 40.5,3.5 v38.9,3.5 36.5,3.5 v35.7,2.7 34.5,1.5 28.2,1.5 27.7,2 C1.1 | v50.14,2.04 50.14,2.64 v51.04,3.54 | v87.7,6.4 88.2,5.9 88.94,5.9 | 88.94,5.9 89.8,5.9 90.3,5.4 | 90.3,5.4 90.3,4.1 | 90.3,4.1 90.3,2.3 89.7,1.7 82.1,1.7 81.45,2.35 MOTOR.1 | v89.45,4.66 89.45,5.39 88.94,5.9 | v91.78,3.57 90.83,3.57 90.3,4.1 | v91.77,6.5 90.67,5.4 90.3,5.4 | v86,13.1 86,12.58 86.48,12.1 86.48,10.12 GPIO40.39 | U$10.1 21.25,3.7 | 21.25,3.7 21.25,4.5 C14.1 21.25,5.3 | U$9.1 21.25,8.8 | 21.25,8.8 21.25,9.5 C10.1 | C1.1 27.7,4.52 LED1.GND | 21.25,5.3 U$9.3 21.95,7.45 22.2,7.7 22.2,8.5 21.9,8.8 21.25,8.8 | C2.1 39.83,47.87 38.9,48.8 | 38.9,48.8 38.9,49.88 IC2.1 | 38.9,48.8 38.3,48.8 | 38.3,48.8 37.7,48.8 | 37.7,48.8 37,48.8 | 37,48.8 36.5,48.8 36.35,48.95 IC2.5 | 37,48.8 IC2.4 C26.1 36.6,53.16 36.6,54.2 36.76,54.36 | IC2.3 37.7,49.88 37.7,48.8 | IC2.2 38.3,48.8 | C8.1 40.3,70.06 IC1.2 40.28,68.58 40.28,67.3 | 40.28,67.3 C7.1 40.28,63.08 40.26,63.05 C6.1 39.34,62.66 C5.1 | 44.65,58.65 R65.1 R9.1 R17.1 R45.1 45.35,54.2 45.35,52.65 44.13,51.43 T1.1
  Top 0.152: 44.65,58.65 44.65,60.45 44.2,60.9 v44.1,60.9 | 40.28,70.2 C8.1 | C3.1 37.08,41.47 U$11.#2 37.93,40.4 v38,40.4 39,39.4 39,38.2 36.9,36.1 34.4,36.1 33.5,37 v33.2,37 | R1.1 34.44,39.74 | R1.1 34.08,39.26 R3.1 32.9,39.26 | 27.89,53.45 C11.1 29,51.6 v28.7,51.3 | 27.89,53.45 U1.5 27.89,55.2 v27,56.1 | v36.6,45.9 36.35,45.65 IC2.24 | U$14.22:GND_J1L 20.03,13.53 18.5,12 v18.3,12 15.5,9.2 11.8,9.2 | T1.1 | C2.1 40.97,47.87 v41.7,48.6 | v41.8,50.6 41,51.4 T1.1 | IC2.14 30.17,49.6 v29.4,49.6 29.4,49.5 v30.8,48.1 | v26.7,49.4 29.3,46.8 29.3,44.7 v29.1,44.5 29.1,41.6 30.84,39.86 32.26,39.86 32.3,39.9 32.9,39.3 32.9,39.26 | 32.9,39.26 32.8,39.26 32.34,38.8 v31.5,38.8 31.1,39.2 v29.6,39.2 | v11.7,9.2 11.8,9.2 | v20.1,5.3 21.25,5.3 | 11.8,9.2 11.6,9 11.6,5.4 14.3,2.7 v18.6,2.7 18.95,2.35 U$10.3 21.95,2.35 22.3,2.7 22.3,3.4 22,3.7 21.25,3.7 | C1.1 26.83,2.2 v25.4,2.2 | v17.4,18.8 17.4,15.4 16.2,14.2 v16.2,14.1 16.2,12.7 v15,11.5 | v11.7,9.2 9.3,9.2 v6.9,11.6 | v42.6,66.2 42.4,66.2 41.3,67.3 40.28,67.3 | v6.2,14.1 6.2,17.7 7,18.5 v7,20.3 7,20.5 v8.2,21.7 8.2,22.87 7.22,23.85 v7.22,24.25 | R1.1 34.44,39.06 C15.1 | R66.2 14.97,31.37 15.37,31.77 R46.2 15.3,32.45 v15.3,33.9 | 14.4,39.8 Q2.S 14.45,39.45 v13.4,38.4 | 14.4,39.8 R62.2 | R55.2 14.4,46.4 | 14.4,46.4 15.4,46.4 Q1.S 16.7,47.4 16.7,47.8 17.3,48.4 | R24.2 15.4,49.9 Q3.S 15.95,49.75 17.3,48.4 | R32.2 15.55,62.5 Q5.S 18.3,63.75 18.3,65.4 17.3,66.4 | C9.1 19.5,41.6 18.5,40.6 R60.2 17.7,40.9 17.7,41.2 17.2,41.7 16.1,41.7 15.5,41.1 15.5,40.4 14.9,39.8 14.4,39.8 | R6.2 18.4,48.4 17.3,48.4 | v15.2,56.5 14.3,57.4 Q4.S 14.05,57.35 R33.2 11.85,56.5 v11.6,56.5
  Top 0.152: 17.3,66.4 16.3,66.4 v15.6,65.7 | v14.3,44.7 14.3,46.3 14.4,46.4 | v33.3,34.9 32.91,35.3 28.5,35.3 26.1,37.7 19.6,37.7 C20.1 | v28.9,58 28.7,58.2 19.7,58.2 C4.1 | R68.2 17.7,31.4 17.7,30.9 15.2,28.4 4.4,28.4 v4.2,28.6 | C8.1 40.22,71.28 39.1,72.4 8.6,72.4 1.9,65.7 1.9,63.9 3,62.8 1.3 3.59,64.39 4.3,65.1 5.45,65.1 R7.2 | v32.4,4 31.5,4.9 v31.5,6 | v11.7,9.2 9.76,7.26 v9.76,6.47 | v8.49,5.2 v9.76,3.93 | v4.68,5.2 v3.41,6.47 v2.14,7.74 | v2.14,5.2 v3.41,3.93 | v4.68,2.66 v5.95,3.93 | v4.68,10.28 4.68,11.55 v5.95,12.82 | C2.1 42.9,45.77 v42.9,44.1 | 17.3,66.4 18,66.4 v18.6,67 18.6,68.6 v18.7,68.7 | v28.3,61.6 29.9,61.6 v31.3,60.2 | v33.9,60.9 33,60.9 v32.3,61.6 | C8.1 40.34,70.14 v41.5,71.3 | v43.2,70.7 43.2,71.8 v43.3,71.9 | v44.9,71 45.3,71 v46.2,71.9 46.2,71.3 v47.1,70.4 46.6,70.4 v45.9,69.7 | C24.2 C25.2 29.65,30.15 v30.3,30.8 | U$13.18 35.65,31.8 R58.1 35.4,31.9 34.6,32.7 33.7,32.7 33.2,32.2 33.2,31.2 33.6,30.8 33.6,28.6 33.95,28.25 U$13.25 34.44,28.25 34.48,28.2 34.86,28.2 35.15,27.91 U$13.2 35.15,26.05 34.8,25.7 34.7,25.7 34.25,25.25 C28.1 C29.1 34.25,23.45 36,21.7 | C27.1 30.1,25.4 29.65,25.85 C24.2 | R49.1 38.95,23.85 v39.1,24 39.65,24.55 R57.1 C21.1 | 36,21.7 v36.8,21.7 37.1,21.4 | 37.1,21.4 v37.1,18.5 v38.3,19.7 | 37.1,21.4 38.1,21.4 v38.3,21.6 | v31.2,32.2 29.4,32.2 v29.1,32.5 | C24.2 28.9,27.55 v28.9,28.2 28.9,25.7 29.8,24.8 v29.8,24.1 | v33.7,22.3 32.6,21.2 v31.9,21.2 | v33.7,20.3 34.6,20.3 v35.4,21.1 36,21.7 | U$5.4 35.05,53.95 34.4,54.6 v34.4,54.8 | v27.6,52.3 27.6,53.16 27.89,53.45 | 36.76,54.36 36.92,54.2 v38.2,54.2 | 36.76,54.36 U$1.8 | v32.1,46.4 32.8,45.7 v33.5,45.7
  Top 0.152: v52.4,15.3 52.4,15.8 51.8,16.4 50.1,16.4 U$14.21:GND_J3_R | U$1.15 42.83,58.73 43.3,59.2 44.1,59.2 44.65,58.65 | v43.9,69.1 42.6,69.1 v42.1,69.6 | v48.2,71.5 49.3,70.4 v49.4,70.4 | v48.2,69.5 47.23,68.53 U$14.1:GND_J3 | v35.9,19.7 35.9,16.1 v35.7,15.9 | v17.6,25.4 19.5,27.3 v19.5,27.7 | EXT1.8:GND 71.88,16.8 76.15,16.8 ESC_CON.1 | v43.1,41.8 40.9,44 v40.9,44.8 | v41.9,39.9 42.9,38.91 42.9,22.09 v40.3,19.5
  Top 0.813: U$14.22:GND_J1L U$14.22:GND_J1 | U$14.21:GND_J3_R U$14.21:GND_J3 | U$14.1:GND_J3R U$14.1:GND_J3 | TH.3 ST.3 CH5.3 CH4.3 CH3.3 CH2.3 1.3 | U$14.22:GND_J3 U$14.22:GND_J3_R
  Bottom 0.152: GPIO40.9 47.06,7.06 45.6,5.6 45.1,5.6 44.75,5.25 44.75,3.55 | 55,17.4 R28.1 57.12,17.2 EXT1.1:GND 57.4,16.32 v57.4,14.2 57.5,14.1 | 35.2,3.2 v35.7,2.7 34.7,3.7 v34.7,5 33.7,4 | 72.8,11.68 GPIO40.30 74.16,13.04 v76.4,13.04 | R42.2 R41.2 71.8,16.52 EXT1.8:GND | v76.4,13.04 76.6,12.84 78.54,12.84 79.3,13.6 79.3,14 78.1,15.2 77.7,15.2 76.55,16.35 ESC_CON.1 | EXT2.1 62.73,2 v61.14,2 | GPIO40.25 66.08,10.1 61,10.1 GPIO40.20 | v69.16,2.24 70.86,2.24 72.1,1 79.35,1 MOTOR.1 | v55.96,7.54 55.9,7.49 55.9,5.3 55.5,4.9 54.2,4.9 53.6,4.3 GP13.GND 51.06,3.52 v51.04,3.54 | v70.86,5 73.96,5 v75.36,6.4 75.76,6.8 78.8,6.8 79.4,6.2 79.4,4.6 80.3,3.7 80.85,3.7 MOTOR.1 | v75.06,1.9 77.66,1.9 v78.96,3.2 81.35,3.2 MOTOR.1 | v43.24,4.24 44.06,4.24 44.75,3.55 | 44.75,3.55 GP12.GND | v36,6 36.8,6.8 v37.5,6.8 | GPIO40.34 76.4,12.48 v76.4,13.04 | GPIO40.39 87.34,6.62 | 87.34,6.62 87.56,6.4 v87.7,6.4 | v85.58,6.56 86.01,6.13 86.85,6.13 87.34,6.62 | v86,13.1 85.4,13.1 85.1,13.4 83.4,13.4 v82.1,14.7 | v44.1,60.9 43.45,61.55 I2C.GND 42.6,62 v42.6,66.2 | v38,40.4 38,44.5 v36.6,45.9 33.7,45.9 v33.5,45.7 | SPI-LED.GND 18,11.7 v18.3,12 | v41.7,48.6 41.7,50.5 v41.8,50.6 | v27,56.1 v28.9,58 29.7,58.8 32.6,58.8 34.1,57.3 34.1,56.7 33.1,55.7 33.1,55 33.85,54.25 | 33.85,54.25 34.7,53.4 37.4,53.4 v38.2,54.2 | v26.7,49.4 26.9,49.6 v29.4,49.6 29.4,50.6 v28.7,51.3 | R36.1 16.8,19.78 C18.1 | C18.1 15.94,17.97 C17.1 | R13.2 C16.1 | C16.1 13.75,11.95 C13.1 12.15,9.2 v11.7,9.2 | v20.1,5.3 18.6,3.8 v18.6,2.7 19.1,2.2 v25.4,2.2 | v16.2,14.1 16.35,14.25 15.7,14.9 15.1,14.9 14.4,15.6 C12.1 | v17.4,18.8 16.06,18.8 C18.1 | U7.21 8.8,20.4
  Bottom 0.152: 8.8,20.4 8.5,20.4 8.2,20.1 8.2,19.7 | 8.2,19.7 8.2,19.5 | 8.2,19.5 8.2,19.2 8.5,18.9 U7.18 | U7.19 8.3,19.4 8.2,19.5 | U7.6 8.3,12.9 8,13.2 | U7.10 8.3,14.9 8,14.6 8,14.4 | 8,13.2 8,13.3 | 8,13.3 8,13.4 | 8,13.4 8,13.9 | 8,13.9 8,14.4 | U7.9 8,14.4 | 8,14.4 | U7.8 8,13.9 | U7.7 8,13.4 | U7.2 8.3,10.9 8,11.2 8,13.2 | v6.9,11.6 6.9,12.2 8,13.3 | v39.3,14.9 40.1,15.7 44.1,15.7 44.4,15.4 v45,15.4 45.67,16.07 U$14.21:GND_J3 | 8.2,19.7 7.7,19.7 7.2,19.2 7.2,17.6 7.9,16.9 8.4,16.9 | U7.14 8.4,16.9 | U7.15 8.9,17.4 8.4,16.9 | 8,14.4 6.5,14.4 v6.2,14.1 | v7,20.3 8.7,20.3 8.8,20.4 | U7.23 8.5,21.4 v8.2,21.7 | C16.1 14.3,12.2 v15,11.5 | U$3.4 28.55,43.95 v29.1,44.5 | v13.4,38.4 13.4,34.5 | 13.4,34.5 13.4,32 | 13.4,32 13.4,27.05 R36.1 | v15.3,33.9 14.7,34.5 13.4,34.5 | C23.1 29.4,39.4 v29.6,39.2 | v15.6,65.7 15.6,64.8 15.7,64.7 15.7,57 v15.2,56.5 15.2,45.6 v14.3,44.7 13.4,43.8 v13.4,38.4 | v11.6,56.5 10.5,55.4 4.5,55.4 3.59,56.31 CH2.3 | 13.4,32 11.3,29.9 6.84,29.9 TH.3 3.59,29.21 v4.2,28.6 3.9,28.3 v3.9,27.1 | v32.4,4 33.7,4 | v31.5,6 30.4,4.9 v30.4,4.7 | 33.7,4 34,3.7 v34,3.1 | v9.76,6.47 v8.49,5.2 | v9.76,3.93 v11.03,5.2 | v8.49,5.2 v4.68,5.2 | v3.41,6.47 v2.14,5.2 | v3.41,3.93 v4.68,2.66 | v5.95,3.93 v7.22,2.66 | v2.14,7.74 v4.68,10.28 | v5.95,12.82 v4.68,14.09 3.98,13.39 v3.98,12.38 | v42.9,44.1 42.9,42 v43.1,41.8 | v7.22,24.25 5.95,24.25 v5.3,24.9 | v37.1,18.5 37.7,18.5 v39.1,17.1 39.4,17.1 40.3,18 v40.3,19.5 | v18.6,67 20,65.6 25.5,65.6 28.3,62.8 v28.3,61.6 | v31.3,60.2 33.2,60.2 v33.9,60.9 | v41.5,71.3 42.1,70.7 v43.2,70.7 | v43.3,71.9 44.2,71 v44.9,71 | v8.49,5.2 8.49,5.6 v7.49,6.6 | v38.3,21.6 38.3,23.2 v39.1,24 | v30.3,30.8 30.3,31.3 v31.2,32.2
  Bottom 0.152: v33.7,22.3 33.1,22.9 v31.6,22.9 30.4,24.1 v29.8,24.1 29.1,23.4 v29.1,21.7 28.7,21.3 27.2,21.3 26,20.1 v26,19.9 | v31.9,21.2 32.8,21.2 v33.7,20.3 | v35.4,21.1 35.9,20.6 v35.9,19.7 | v34.4,54.8 33.85,54.25 | C30.1 30.15,54.85 v27.6,52.3 | v32.3,48.1 v30.8,48.1 32.1,46.8 v32.1,46.4 | GPIO40.14 49.95,13.53 U$14.22:GND_J3_R 50.63,13.53 v52.4,15.3 | v33.3,34.9 33.2,35 v33.2,37 31.5,38.7 v31.5,38.8 | v45.9,69.7 44.5,69.7 v43.9,69.1 | v47.1,70.4 v48.2,71.5 | v49.4,70.4 48.5,69.5 v48.2,69.5 | v18.7,68.7 v25.5,68.7 26.6,69.8 33.6,69.8 37.1,66.3 v37.1,64.1 | v35.7,15.9 35.7,13.2 v35.2,12.7 | v8.4,60.6 5.79,60.6 1.3 | v8.5,50.2 5.99,50.2 CH4.3 | v8.5,45.3 6.09,45.3 CH5.3 | v8.6,40.5 4.51,40.5 3.59,39.58 ST.3 | v7.8,31.2 9.1,31.2 10.1,32.2 10.1,34 8.8,35.3 v8.2,35.3 9.3,36.4 v10.7,36.4 11.4,36.4 v13.4,38.4 | R36.1 16.8,24.6 v17.6,25.4 | v31,63.3 32.3,62 v32.3,61.6 | v88.47,19 89.67,19 v90.47,19.8 93.4,16.87 93.4,8.13 v91.77,6.5 | v40.9,44.8 41.2,44.5 41.2,41.6 41.5,41.3 41.5,40.3 v41.9,39.9
  pour Bottom (rank 6): -12.8,100.7 100.4,100.7 100.4,-1.3 -12.8,-1.3
  pour Top (rank 6): -13,101.2 101,101.2 101,-2.7 -13,-2.7
  pour Bottom (no thermals): 5.1,32.6 5.1,38.9 5.5,39.3 6.8,39.3 7.1,39 7.1,32.5 6.6,32 5.7,32
GPIO4
  Top 0.152: R39.2 R40.1 44.1,8.38 44.46,8.74 | 44.46,8.74 GPIO40.7 | 44.46,8.74 44.46,8.76 45.8,10.1 50.3,10.1 50.8,10.6 50.8,12.2 51.3,12.7 52.4,12.7 56.2,16.5 56.2,17 57.2,18 66.32,18 EXT1.6:MCK
GPIO12  (via drill 0.35)
  Top 0.152: v54.4,2 60.1,2 62.8,4.7 67.2,4.7 v67.6,5.1 | v73.1,6.5 73.7,7.1 73.7,10.04 GPIO40.32
  Bottom 0.152: R43.2 48.6,3.7 GP12.I/O 49.8,3.5 51.5,1.8 54.2,1.8 v54.4,2 | v67.6,5.1 69,6.5 v73.1,6.5
GPIO13
  Bottom 0.152: GPIO40.33 77.54,8.24 76.7,7.4 75.3,7.4 74.9,7 74,7 73.8,7.2 68.6,7.2 68.1,6.7 66.4,6.7 65.7,7.4 63.9,7.4 63.2,6.7 61.7,6.7 61.4,7 58.9,7 58.3,6.4 R44.2 58.7,5.2 59.6,4.3 GP13.IO
GPIO18
  Bottom 0.152: GPIO40.12 49.6,11 50.5,10.1 52.9,10.1 53.4,10.6 53.4,12.3 52.7,13 52.7,13.9 53.1,14.3 R30.1 53.4,14.1
GPIO19  (via drill 0.35)
  Top 0.152: v78.3,13.8 78.7,13.8 arc-103 79.1,13.3 arc-18 78.93,12.87 arc43 78.8,12.1 78.8,9.48 arc45 79,9 arc45 79.48,8.8 GPIO40.35
  Bottom 0.152: v78.3,13.8 arc-45 77.28,14.22 R38.1
GPIO20
  Top 0.152: EXT1.7:DIN arc95 69.7,15.32 arc73 70.4,15.24 arc-85 71.5,15 arc69 72.3,14.7 arc71 73.25,15.81 arc-159 74.08,15.89 arc-8 74.47,14.02 arc111 75.06,13.72 arc69 75.25,14.1 arc-44 75.57,15.37 arc-122 76.18,15.29 arc-15 76.44,14.22 arc65 76.7,13.9 arc82 77.67,14.29 arc-11 78,14.8 arc-36 78.6,15.2 arc-31 79.2,15.2 arc-78 79.7,14.5 79.7,13.1 arc180 80.4,13.1 80.4,15 arc-180 81.1,15 81.1,12.63 arc86 81.39,12.32 arc94 81.74,12.64 arc-69 82.44,13.64 arc-85 83.01,13.41 arc-73 GPIO40.38
  Bottom 0.152: R42.1 69.1,16.02 EXT1.7:DIN
GPIO21  (via drill 0.35)
  Top 0.152: GPIO40.40 arc-3 85.2,12.6 arc97 85,12.8 arc-51 84.5,13 arc-123 84.7,13.6 arc-8 85.6,13.7 arc147 85.7,14.1 arc33 84.9,14.3 arc-125 84.5,15 arc-41 86,16.1 arc90 87,17.1 87,18.5 arc90 v86.2,19.3
  Bottom 0.152: v86.2,19.3 84.3,19.3 R18.1
GPIO22  (via drill 0.35)
  Top 0.152: v39.44,18.36 37.94,16.86 37.94,14.56 v39.5,13 | v39.7,30.7 39.65,30.65 R71.1 | v45.6,13.6 45.6,13.9 46.5,14.8 50.9,14.8 51.9,13.8 52.4,13.8 v54.1,15.5
  Bottom 0.152: GPIO40.15 56,10.12 56,12 54.4,13.6 54.4,15.2 v54.1,15.5 | v39.44,18.36 39.6,18.51 39.6,22.9 40,23.3 40,30.4 v39.7,30.7 | v45.6,13.6 45.2,13.2 39.7,13.2 v39.5,13
GPIO23  (via drill 0.35)
  Top 0.152: EXT2.4 70.2,1.9 69.5,1.2 53,1.2 52,2.2 v52,4.9 52,4.8 | v53.4,7.7 v52.4,6.7
  Bottom 0.152: v52,4.9 52,6.3 v52.4,6.7 | v53.4,7.7 53.4,9.6 54.68,10.88 GPIO40.16
GPIO24  (via drill 0.35)
  Top 0.152: GPIO40.18 58.46,10.1 60.6,10.1 61,9.7 61,7.9 61.7,7.2 63.41,7.2 v64.1,6.51
  Bottom 0.152: EXT2.3 65.16,6.51 v64.1,6.51
GPIO25  (via drill 0.35)
  Top 0.152: EXT2.7 76.2,4.6 75.3,5.5 72.6,5.5 71.2,6.9 v71.2,7.96 | v66.3,12.7 66.1,12.5 66.1,10.4 65.8,10.1 62.8,10.1 62.3,10.6 GPIO40.22
  Bottom 0.152: v71.2,7.96 71.2,9.8 70.9,10.1 69.2,10.1 68.7,10.6 68.7,12.1 68.1,12.7 v66.3,12.7
GPIO26
  Top 0.152: EXT2.6 74.2,1.7 74.9,1 79.4,1 79.8,1.4 79.8,3.6 79.2,4.2 arc-90 79.2,5.1 arc-58 79.9,5.3 arc37 82.1,5.5 arc90 82.4,5.8 82.4,6.1 arc90 82.2,6.3 79,6.3 arc-90 78.6,6.7 arc-90 79,7.1 81.1,7.1 82.62,8.62 GPIO40.37
GPIO27  (via drill 0.35)
  Top 0.152: EXT2.5 72.2,4.8 70.95,6.05 68.55,6.05 68.2,6.4 67.1,6.4 66.4,5.7 62.5,5.7 61.5,6.7 57.5,6.7 56.6,5.8 v54.9,5.8
  Bottom 0.152: v54.9,5.8 54.4,5.8 52.14,8.06 GPIO40.13
LED0  (via drill 0.35)
  Top 0.152: IC2.6 35.7,48.8 v35.2,48.3 | v32.3,51.2 32.55,51.45 R2.2
  Bottom 0.152: v35.2,48.3 33.5,48.3 32.3,49.5 v32.3,51.2
LED1
  Top 0.152: R4.2 34.7,51 35.05,50.65 IC2.7
M_SENSOR1  (via drill 0.35)
  Top 0.152: v27.3,41.5 26.4,42.4 v26.4,42.8
  Top 0.813: U$14.9:GPIO16 U$14.9:GPIO16_L
  Bottom 0.152: R47.1 28.95,46.55 27.65,47.85 25.85,47.85 24.55,46.55 U$14.9:GPIO16 23.1,45.28 23.1,43 23.3,42.8 v26.4,42.8 | U$3.7 27.55,41.25 v27.3,41.5
M_SENSOR2
  Top 0.813: U$14.10:GPIO17_L U$14.10:GPIO17
  Bottom 0.152: R48.1 | U$3.2 27.55,43.95 26.45,45.05 R48.1 | R48.1 25.36,44.01 U$14.10:GPIO17
M_SENSOR3
  Top 0.813: U$14.11:GPIO18_L U$14.11:GPIO18
  Bottom 0.152: U$3.5 28.53,40.43 29.06,39.9 30.1,39.9 30.6,39.4 30.6,39 30.2,38.6 29.21,38.6 R59.1 28.23,38.07 27.8,38.5 26.8,38.5 25.6,39.7 25.6,40.7 24.83,41.47 U$14.11:GPIO18
MOSI2  (via drill 0.35)
  Top 0.152: LED1.SDO 27.9,7.6 27.9,9.1 27.5,9.5 v27,9.5
  Bottom 0.152: v27,9.5 24.25,9.5 SPI-LED.DI
MOSI_HV  (via drill 0.35)
  Top 0.152: U$9.4 23.5,7.1 v23.5,6.4 | v24.6,5.1 25.6,5.1 26.66,6.16 LED1.SDI
  Bottom 0.152: v23.5,6.4 24.6,5.3 v24.6,5.1
MOSI_LV
  Top 0.152: U$9.2 20.4,8.1 20,8.5 20,10.7 20.6,11.3 25.9,11.3 28.6,14 28.6,18.6 30.5,20.5 30.5,22.5 30,23 29.3,23 28.7,23.6 28.7,25 28.2,25.5 R10.2
MOTORCONTROLPOWER  (via drill 0.35)
  Top 0.152: MOTOR.6 86.9,5.15 86.9,14.39 v86.04,15.24 | ESC_CON.6 84.05,18.55 82.1,20.5 53,20.5 52.4,19.9 45.6,19.9 v45.2,19.5
  Bottom 0.152: v86.04,15.24 84.89,16.4 ESC_CON.6 | 89,3.05 MOTOR.6 | C23.2 27.05,39.6 U$3.8 26.75,40.45 26.3,40.9 26.3,41.6 27.1,42.4 30.6,42.4 38.3,34.7 41.3,34.7 42.6,33.4 42.6,22.1 v45.2,19.5
N$3
  Bottom 0.152: C22.2 11.15,24.4 U7.29
N$4
  Top 0.152: R45.2 42.98,55.48 U$1.10
N$5  (via drill 0.35)
  Top 0.152: R63.1 43.1,18.7 45.2,20.8 v45.2,23.9
  Top 0.813: U$14.2:GPIO43_R U$14.2:GPIO43
  Bottom 0.152: U$14.2:GPIO43 48.5,63.06 48.5,58.5 48,58 46.2,58 45.2,57 45.2,33.6 46.2,32.6 48.2,32.6 48.6,32.2 48.6,30.4 48.2,30 46.1,30 45.2,29.1 v45.2,23.9
N$6
  Top 0.152: R26.1 12.16,55.69 U2.1
N$7
  Top 0.152: R3.2 32.95,41.45 33.7,42.2 34.6,42.2 35.7,43.3 IC2.23
N$8  (via drill 0.35)
  Top 0.152: R64.1 41.2,18.3 44.1,21.2 44.1,45.1 43.5,45.7 v43.5,48
  Top 0.813: U$14.3:GPIO44_R U$14.3:GPIO44
  Bottom 0.152: v43.5,48 43.5,58.2 47.09,61.79 U$14.3:GPIO44
N$9
  Top 0.152: U1.4 27.89,66.54 R15.1 27.5,67.89 27.5,68 27,68.5 R27.2
N$10
  Top 0.152: IC2.21 34.4,43.4 34,43 32.54,43 TP2.TP
N$11
  Top 0.152: U1.3 29.16,68.03 28.7,68.5 R27.1 28.3,69.2 27.9,69.6 20.8,69.6 20.2,69 20.2,64.3 20.5,64 20.5,62.4 18.8,60.7 17.3,60.7 16.4,59.8 Q4.D
N$12
  Top 0.152: R16.1 32.39,68.25 R29.1 32.39,65.78 U1.1
N$13
  Top 0.152: U2.2 13.26,54.62 16.89,54.62 17.7,53.8 R53.2 17.7,50.85 Q3.D
N$14
  Bottom 0.152: U7.5 11.2,12.4 11.5,12.7 11.5,13.2 11.95,13.65 R13.1
N$15
  Top 0.152: R54.1 13.4,48.8 14.2,48 R55.1 14.45,48.15 Q1.G
N$16
  Bottom 0.152: U7.27 11.21,23.4 11.21,23.41 12.8,23.41 13.18,23.03 C19.2
N$17
  Bottom 0.152: C13.2 11.5,10.8 10.9,11.4 U7.3
N$18
  Top 0.152: U3.1 10.06,44.63 9.8,44.9 9.8,46.1 11.5,47.8 R56.1
N$19
  Top 0.152: U$1.11 42.17,56.2 R17.2
N$21
  Bottom 0.152: U7.26 11.1,22.9 C19.1
N$22
  Bottom 0.152: U7.28 13,23.9 13.2,24.1 C22.1
N$23
  Top 0.152: R8.1 14.8,52.6 | Q3.G 14.95,52.25 R8.1 | R24.1 14.2,52 R8.1
N$24
  Top 0.152: R7.1 5.9,67.55 RCPWR.CATHODE
N$25
  Bottom 0.152: U7.4 11.5,11.9 11.8,12.2 C16.2
N$26
  Top 0.152: U3.2 14.46,43.37 16.5,45.4 16.8,45.4 17,45.6 17,46.35 Q1.D
N$27
  Top 0.152: CH4.1 11.19,50.4 R54.2
N$28
  Top 0.152: Q2.G 14.2,41.4 R62.1 13,41.1 12.6,41.1 R61.1
N$29
  Top 0.152: U4.1 12,36.99 R67.1
N$30
  Top 0.152: Q5.D 19.55,63.65 19.55,69.45 20.5,70.4 29.1,70.4 29.8,69.7 29.8,67.5 30.34,66.96 30.74,66.96 | U1.2 30.43,66.66 30.74,66.96 | 30.74,66.96 R29.2
N$31
  Top 0.152: R9.2 43.33,57.42 U$1.13
N$32
  Bottom 0.152: R31.1 13.18,18.27 12.3,17.4 12.3,17.3 R25.2 12,15.75 C12.2 11.85,15 12.25,14.6 14.9,14.6 15.2,14.3 15.2,13 D1.ANODE
N$33
  Top 0.152: 15.55,64.1 R32.1 | R34.2 14.98,64.67 R32.1 | R32.1 16.8,64.15 Q5.G
N$34
  Top 0.152: U4.2 13.06,35.16 13.7,35.8 13.7,37.45 16.75,40.5 Q2.D
N$35
  Top 0.152: R65.2 43.42,58.08 U$1.14
N$36
  Top 0.152: R61.2 9.29,42.1 CH5.1
N$37  (via drill 0.35)
  Top 0.152: v14.1,21.3 10.6,21.3 8,18.7 v8,18.2
  Bottom 0.152: R36.2 14.8,22.7 R37.1 14.95,22.15 v14.1,21.3 | U7.16 8.3,17.9 arc-90 v8,18.2
N$38
  Top 0.152: R35.2 15,60.19 Q4.G 13.75,58.95 R33.1
N$40
  Top 0.152: IC1.4 39.35,65.06 C6.2
N$41
  Top 0.152: R1.2 34.58,41.36 U$11.#3 35.77,42.13 | 35.77,42.13 C3.2 | IC2.25 37,43.4 36.6,43 36.2,43 35.77,42.57 35.77,42.13
N$42
  Top 0.152: U$13.9 38.5,27.75 C21.2
N$43
  Top 0.152: U$13.27 32.6,27.25 X1.1 32.15,26.8 C24.1
N$44
  Top 0.152: U$13.26 33.55,27.75 33.1,28.2 33.1,28.9 32.65,29.35 X1.2 32.15,29.4 C25.1
N$45
  Top 0.152: R49.2 36.65,25.6 U$13.5
N$46
  Top 0.152: R57.2 37.91,25.8 U$13.6
N$47
  Top 0.813: U$14.20:GPIO14_L U$14.20:GPIO14
N$48
  Top 0.813: U$14.19:GPIO13_L U$14.19:GPIO13
  Bottom 0.152: R79.2 26.2,21.9 25.45,21.15 U$14.19:GPIO13
N$49  (via drill 0.35)
  Top 0.152: R78.2 27.45,30.05 v28.4,31
  Top 0.813: U$14.16:GPIO10_L U$14.16:GPIO10
  Bottom 0.152: v28.4,31 27.46,30.06 25.47,30.06 24.37,28.96 U$14.16:GPIO10
N$50
  Bottom 0.152: U7.20 11.49,19.9 R19.2
N$51
  Top 0.813: U$14.14:GPIO46 U$14.14:GPIO46_L
N$52
  Top 0.813: U$14.13:GPIO3 U$14.13:GPIO3_L
N$53
  Top 0.152: R72.1 R58.2 36.65,31.75 36.15,31.25 U$13.17
N$54
  Top 0.152: R70.1 36.15,25.1 U$13.4
N$55
  Top 0.813: U$14.3:RST_L U$14.3:RST
N$56
  Top 0.813: U$14.1:3V3 U$14.1:3V3_L
N$57
  Top 0.813: U$14.2:3V3_L U$14.2:3V3
N$58
  Top 0.813: U$14.20:GPIO19 U$14.20:GPIO19_R
N$59
  Top 0.813: U$14.19:GPIO20_R U$14.19:GPIO20
N$60
  Top 0.813: U$14.18:GPIO21 U$14.18:GPIO21_R
N$61
  Top 0.813: U$14.16:GPIO48 U$14.16:GPIO48_R
N$62
  Top 0.813: U$14.14:GPIO0 U$14.14:GPIO0_R
N$63
  Top 0.813: U$14.13:GPIO35 U$14.13:GPIO35_R
N$64
  Top 0.813: U$14.12:GPIO36 U$14.12:GPIO36_R
N$65
  Top 0.813: U$14.11:GPIO37 U$14.11:GPIO37_R
N$66
  Top 0.813: U$14.10:GPIO38 U$14.10:GPIO38_R
N$67
  Top 0.813: U$14.9:GPIO39 U$14.9:GPIO39_R
N$68
  Top 0.813: U$14.8:GPIO40_R U$14.8:GPIO40
N$69
  Top 0.813: U$14.7:GPIO41_R U$14.7:GPIO41
N$70
  Top 0.813: U$14.6:GPIO42_R U$14.6:GPIO42
N$71
  Top 0.813: U$14.5:GPIO2_R U$14.5:GPIO2
N$72
  Top 0.813: U$14.4:GPIO1 U$14.4:GPIO1_R
N$74  (via drill 0.35)
  Top 0.152: U$13.10 37.15,28.25 36.6,28.8 v36.6,29.4
  Bottom 0.152: v36.6,29.4 36.6,29.7 37.7,30.8 38.5,30.8 39.2,31.5 TP3.TP
N$75  (via drill 0.35)
  Top 0.152: v36.22,27.28 36.29,27.28 36.77,26.8 37.42,26.8 U$13.7
  Bottom 0.152: TP4.TP 35.7,26.76 v36.22,27.28
N$76  (via drill 0.35)
  Top 0.152: v35.6,28.5 36,28.5 37.25,27.25 U$13.8
  Bottom 0.152: TP5.TP 33.5,26 35.6,28.1 v35.6,28.5
N$77
  Top 0.152: 36.2,58.83 U$1.2 35.17,58.73 34.95,58.95 R75.2 34.05,58.8 31.7,58.8 31.1,58.2 31.1,57.3 31.6,56.8 32.6,56.8 33.2,57.4 33.9,57.4 34.05,57.25 U$5.7
N$78
  Top 0.152: U$1.5 35.27,56.77 U$5.5 35.05,56.35 35.25,56.15 35.25,54.4 35.7,53.95 R74.2
N$79
  Top 0.152: R73.2 33.25,54.85 34.55,56.15 U$5.6
NC_MS1
  Top 0.152: MOTOR.5 83.9,6.65 83.9,12.3 83.75,12.45 83.75,14.45 82.55,15.65 ESC_CON.5
  Bottom 0.152: TP1.TP 83.79,14.55 82.55,15.79 ESC_CON.5
PCH1
  Top 0.152: 1.1 9.09,62.8 10.96,64.67 R12.1
PCH2
  Top 0.152: CH2.1 8.59,58.89 10,60.3 R11.1
PCH_3
  Top 0.152: R8.2 12.1,51.5 9.1,51.5 8.59,52.01 CH3.1
RC_CH1_ST
  Top 0.152: R20.2 12.97,34.32 10.58,34.32 8.59,36.31 ST.1
RC_CH2_TH
  Top 0.152: TH.1 11.64,33.15 R21.2
RCH1  (via drill 0.35)
  Top 0.152: 13.17,32.31 R20.1 14.23,32.42 R46.1 14.27,36.87 17,39.6 18.8,39.6 v19.2,40 | v32.2,57.8 32.5,58.1 34.5,58.1 35.17,57.42 U$1.4
  Bottom 0.152: v19.2,40 19.2,52.3 20,53.1 25.7,53.1 30.4,57.8 v32.2,57.8
RCH2  (via drill 0.35)
  Top 0.152: U$1.7 38.83,55.48 v39.3,55 | R66.1 12.93,31.47 R21.1 11.72,31.38 12.7,30.4 15.2,30.4 16.2,31.4 16.2,37.9 17.2,38.9 19.9,38.9 20.3,39.3 v20.3,41.1
  Bottom 0.152: v39.3,55 39.3,53.3 38.7,52.7 29.1,52.7 26.8,50.4 20.8,50.4 20.1,49.7 20.1,41.3 v20.3,41.1
RECV_CH1  (via drill 0.35)
  Top 0.152: R34.1 R12.2 11.85,63.2 v10.6,63.2 | v9.7,64.9 16,71.2 33.4,71.2 35.8,68.8 v35.8,65.3 | U$1.3 37.62,58.08 38.5,57.2 v39.1,57.2
  Bottom 0.152: v9.7,64.9 9.7,64.1 v10.6,63.2 | v39.1,57.2 39.3,57.4 39.3,57.8 38.9,58.2 36.3,58.2 35,59.5 35,61.1 35.2,61.3 35.2,64.7 v35.8,65.3
RECV_CH2  (via drill 0.35)
  Top 0.152: U$1.6 37.92,56.12 38,56.2 v38,56.3 | R11.2 12.25,61.9 R35.1 13.4,61.4 13.9,61.9 14.4,61.9 14.67,61.63 18.23,61.63 v18.7,62.1
  Bottom 0.152: v38,56.3 38.1,56.3 38.1,57.1 37.7,57.5 34.9,57.5 33.1,59.3 29.3,59.3 28,60.6 20.2,60.6 v18.7,62.1
RESET_SIG
  Bottom 0.152: R31.2 11.49,18.4 U7.17
RX_JETSON
  Top 0.152: GPIO40.10 46.66,11.34 43.1,14.9 R63.2
SCL  (via drill 0.35)
  Top 0.152: v37.9,46.8 37.65,46.55 IC2.26 | v5.8,18.9 5.8,23.9 7.9,26 16,26 20.2,30.2 20.8,30.2 21.83,31.23 U$14.15:GPIO9_L | v43.2,10.1 43.2,12.5 41.8,13.9 41.1,13.9 40.2,14.8 40.2,18.4 43.5,21.7 43.5,39.7 43.3,39.9 v43.1,39.9 42.2,40.8 41.7,40.8 40.7,39.8 40.7,38.3 36.5,34.1 34.2,34.1 33.9,33.8 33.6,33.8 | 33.6,33.8 28.26,33.8 26.56,32.1 26.1,32.1 25.2,31.2 24.48,31.2 U$14.15:GPIO9 | U$13.19 35.15,30.15 35.4,29.9 v35.4,29.8 | v32.6,30.7 32.4,30.9 32.4,32.6 33.6,33.8
  Top 0.813: U$14.15:GPIO9 U$14.15:GPIO9_L
  Bottom 0.152: v38.3,2.1 40.1,2.1 41.72,3.72 R22.1 41.77,8.6 GPIO40.5 43.24,10.06 v43.2,10.1 | I2C.SCL 36.15,59.75 36.9,59 39,59 40.7,57.3 40.7,53.7 37.9,50.9 v37.9,46.8 38.4,47.3 40.3,47.3 42,45.6 42,44.5 41.8,44.3 41.8,43.6 42.2,43.2 42.2,40.8 v43.1,39.9 | v5.8,18.9 5.8,18 7.4,16.4 U7.13 | v35.4,29.8 35,29.4 33.9,29.4 v32.6,30.7
SDA  (via drill 0.35)
  Top 0.152: GPIO40.3 38.1,10.14 38.1,12.9 37,14 37,17.1 42.1,22.2 v42.1,38.6 | v38.9,46.2 38.3,45.6 IC2.27 | v19.3,31.4 15.3,27.4 6,27.4 4.2,25.6 v4.2,16.6 | v40.7,40.9 39.8,40 39.8,38.2 37.1,35.5 35.1,35.5 v34.8,35.2 34.3,35.2 33.5,36 33,36 32.9,35.9 28.8,35.9 25.77,38.93 U$14.12:GPIO8 | U$13.20 33.9,31.19 v33.9,31.8
  Top 0.813: U$14.12:GPIO8 U$14.12:GPIO8_L
  Bottom 0.152: 38.73,5.13 R23.1 38.43,5.55 38.43,7.79 GPIO40.3 | v38.9,46.2 39.7,46.2 40.05,45.85 | 40.1,45.8 40.05,45.85 | I2C.SDA 38.15,60.75 42.6,56.3 42.6,45.6 44,44.2 44,39.7 42.8,38.5 42.2,38.5 v42.1,38.6 40.7,40 v40.7,40.9 40.7,43 40.05,43.65 40.05,45.85 | U$14.12:GPIO8_L 20.93,38.93 19.5,37.5 19.5,31.6 v19.3,31.4 | v4.2,16.6 5.4,15.4 8,15.4 | 8,15.4 U7.11 | U7.12 8.5,15.9 8,15.4 | v33.9,31.8 34.4,32.3 35.8,32.3 36.3,32.8 36.3,33.6 35.9,34 34.2,34 34.1,34.1 34.1,34.7 34.6,35.2 v34.8,35.2
SEL
  Top 0.152: T1.3 40.34,58.26 39.23,59.38 U$1.1 | R5.1 41.55,53.03 T1.3 | T1.3 38.89,53.03 C26.2
SENSE1_ESC  (via drill 0.35)
  Top 0.152: ESC_CON.2 78.05,18.15 76.91,19.29 v76.31,19.29
  Bottom 0.152: R50.2 81.2,7.7 81.4,7.9 81.4,12.1 80.2,13.3 80.2,14.1 78.05,16.25 ESC_CON.2 | v76.31,19.29 76.01,19.29 75,20.3 51,20.3 50.6,19.9 46.1,19.9 44,22 44,33 41.6,35.4 38.4,35.4 31,42.8 27.4,42.8 27.05,43.15 U$3.1
SENSE1_MOTOR
  Bottom 0.152: R50.1 82.8,3.25 MOTOR.2
SENSE2_ESC  (via drill 0.35)
  Top 0.152: ESC_CON.3 79.55,18.45 v78.8,19.2
  Bottom 0.152: R51.2 83.9,4.8 83.9,12.4 83.5,12.8 82.2,12.8 82,13 82,13.26 79.55,15.71 ESC_CON.3 | v78.8,19.2 77.9,19.2 77,18.3 75.8,18.3 74.6,19.5 53,19.5 50.9,17.4 43.6,17.4 40.5,20.5 40.5,32.7 39.9,33.3 38.1,33.3 31,40.4 29.8,40.4 29,41.2 28.3,41.2 28.05,40.95 U$3.6
SENSE2_MOTOR
  Bottom 0.152: R51.1 84.45,3.75 MOTOR.3 84.5,3.05
SENSE3_ESC  (via drill 0.35)
  Top 0.152: ESC_CON.4 81.05,19.15 80.2,20 54.9,20 52.3,17.4 45.1,17.4 44.2,18.3 v44.2,18.4 | v30.7,41.2 29.9,42 29.9,44.8 v30.8,45.7
  Bottom 0.152: R52.2 88.6,5.2 88.6,6.6 86.9,8.3 86.9,16.6 85.8,17.7 82.3,17.7 81.05,16.45 ESC_CON.4 | v44.2,18.4 44,18.4 41.4,21 41.4,33.3 40.7,34 38.2,34 31,41.2 v30.7,41.2 | v30.8,45.7 29.9,45.7 29.5,45.3 28.6,45.3 28.3,45 28.3,44.73 28.07,44.5 28.07,43.57 U$3.3
SENSE3_MOTOR
  Bottom 0.152: MOTOR.4 85.95,3.65 86.5,4.2 R52.1
SIGNAL_SELCET
  Top 0.152: T1.2 39.69,50.71 40.8,49.6 43.7,49.6 45.1,48.2 45.1,27.5 46.37,26.23 U$14.17:GPIO47
  Top 0.813: U$14.17:GPIO47_R U$14.17:GPIO47
TX_JETSON
  Top 0.152: GPIO40.8 44.52,12.28 41.3,15.5 R64.2
VSPI  (via drill 0.35)
  Top 0.152: v26.1,29.2 26.1,29.3 26.15,29.25 R76.1 | R77.1 26.55,24.35 v26.2,24.7 | v39.8,36.3 36.7,33.2 v35.4,33.2 | R78.1 27.7,32.05 v27.7,32.2
  Top 0.813: U$14.15:GPIO45 U$14.15:GPIO45_R
  Bottom 0.152: R79.1 v26.2,24.7 26.2,29.1 | 26.2,29.1 v26.1,29.2 | U$14.15:GPIO45 46.19,31.31 44.6,32.9 44.6,34.2 42.5,36.3 v39.8,36.3 | v35.4,33.2 35.3,33.1 29.6,33.1 29.4,33.3 28.8,33.3 v27.7,32.2 28.4,32.2 29.2,31.4 29.2,30.4 27.9,29.1 26.2,29.1

## Text on the board
tPlace: 1ch | 2ch | 3ch | 4ch | 5ch | Revision 3.0.5 | ESC_SIDE | 20 | 30 | 40 | 1 | 9 | 19 | 29 | MOTOR_SIDE
bPlace: 3V3 | SCL | SDA | 5V | GND | S/N | Rev 3.0.5 | G | 5V | 21 | 18 | 19 | 20 | G | 4 | G | S2 | P | 5V | GND | S1 | S3 | GND | GND | GND | CLK | MOSI | F-612-3-0-5-A-N-J-0-JLC | 5V | G | G | 5V | 12 | G | 5V | 3V | 13 | G | 5V | 24 | 23 | 27 | 26 | 25
Document: Jetson Nano DevKit / B-01 (A02) | #612 JetRacer Rev 3.0.5 / 2024/07/18
_tNames: I2C-CON | Jetson Nano Border | MC74VHC157 | TLP2270 | TLP291 | LP2985-33DBVR | CUS05F40 | KC2016Z(25MHz,OSC) | PCA9685PW | ESP32S3_DevKitC-1 | Fusion Sensor / BNO055 | brushless motor Sensor / ESC side connector | 0.96inchOLED(Blue) | FC-135 12.5p | Expansion / Jetson I2S Connector and e.t.c | Jetson Orin Nano / Users Hole | brushless motor Sensor / MotorSide connector | Expansion / Jetson SPI Connector and e.t.c | Expansion / GPIO or jetson pwm | SPI-LED CON | AP102-202